# EAGLE design quadbase_ble113 (EAGLE 7.2.0)
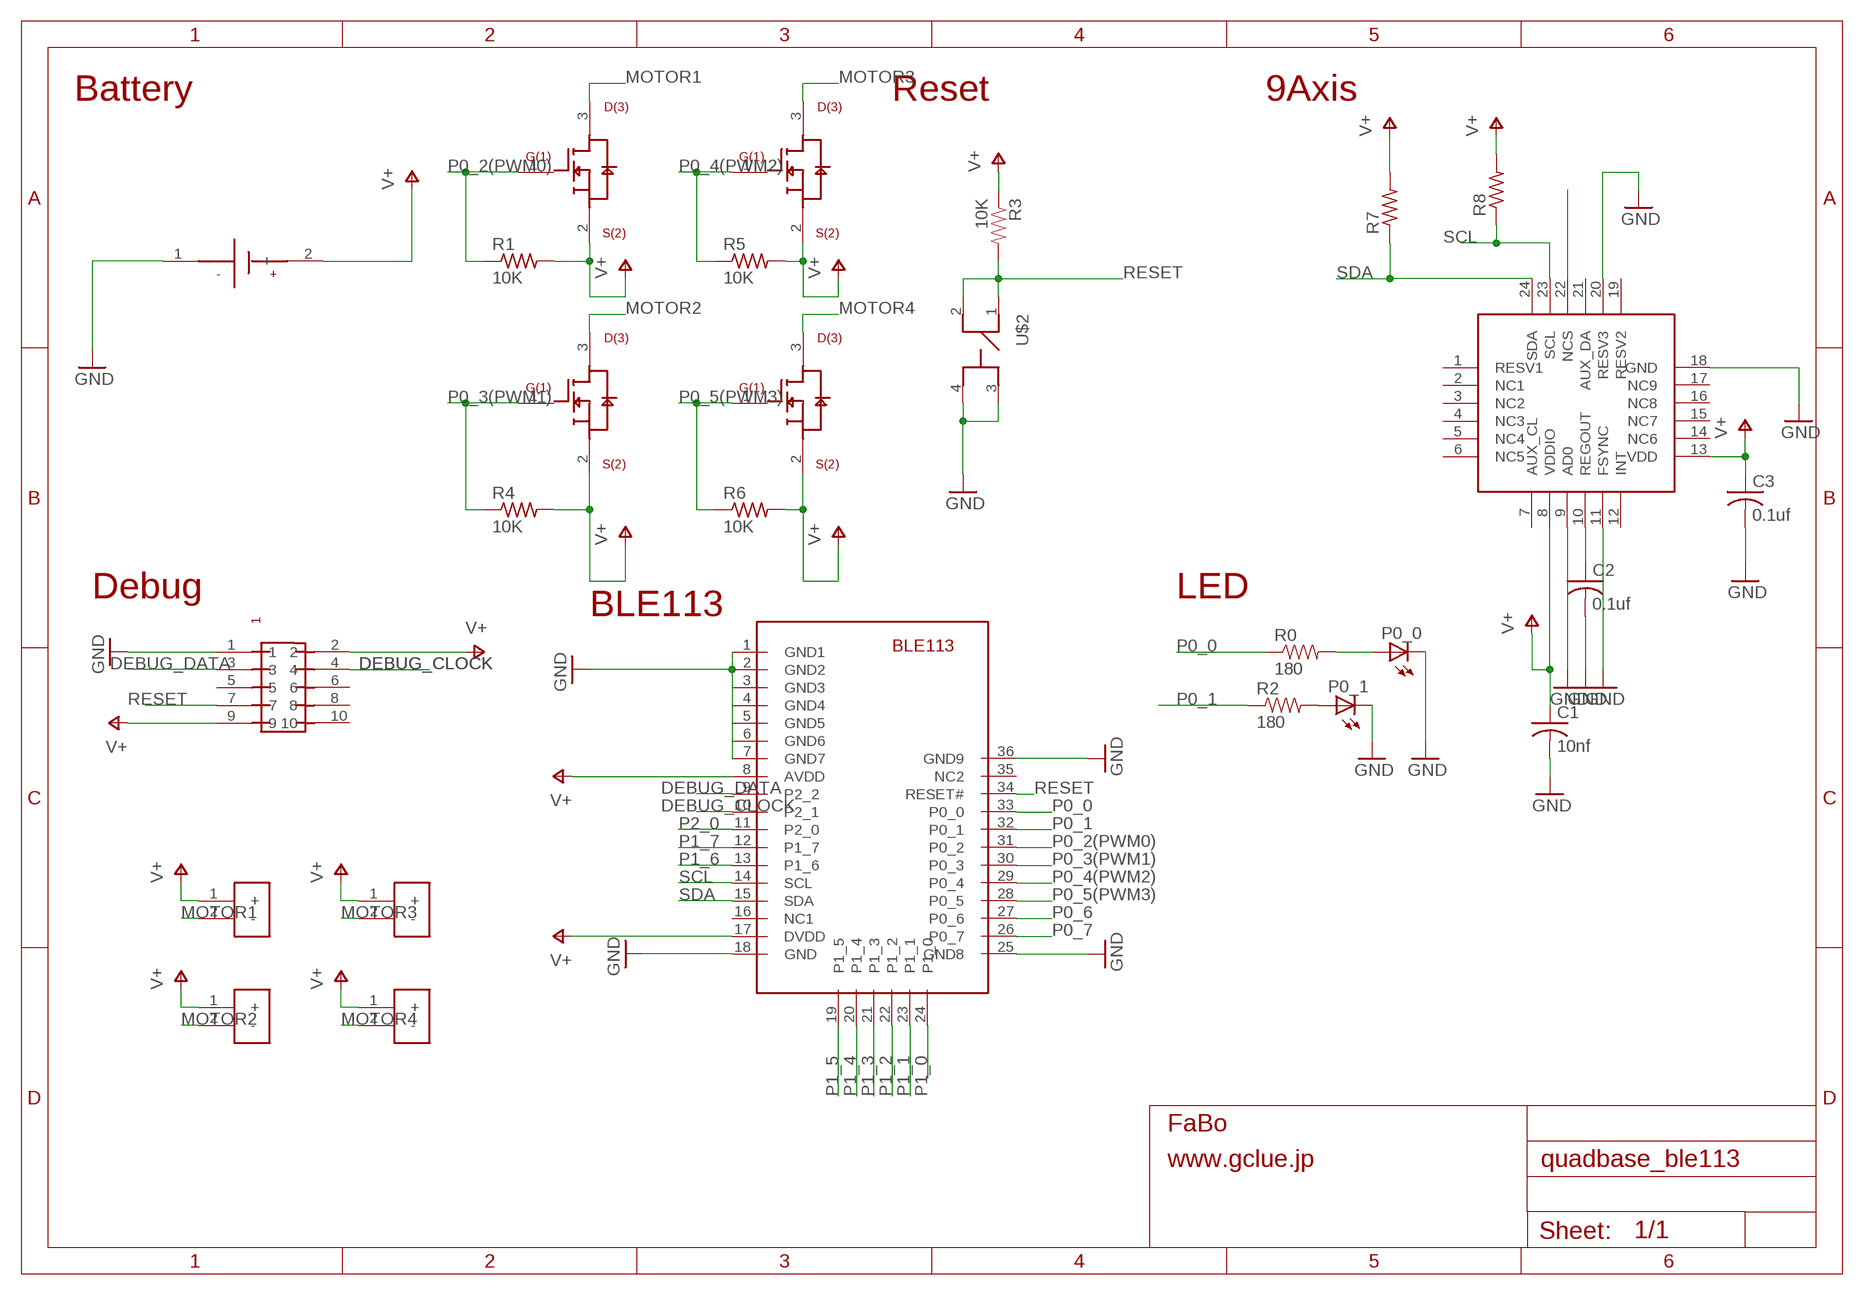
[diagram p0: schematic, sheet 1]

## Parts
C1  10nf  C-USC0603  [C0603]
C2  0.1uf  C-USC0603  [C0603]
C3  0.1uf  C-USC0603  [C0603]
MOTOR1  SMD-MOTOR  [SMD-MOTOR]
MOTOR2  SMD-MOTOR  [SMD-MOTOR]
MOTOR3  SMD-MOTOR  [SMD-MOTOR]
MOTOR4  SMD-MOTOR  [SMD-MOTOR]
P0_0  LEDCHIP-LED0603  [CHIP-LED0603]
P0_1  LEDCHIP-LED0603  [CHIP-LED0603]
R0  180  RESISTOR0603-RES  [0603-RES]
R1  10K  R-US_R0603  [R0603]
R2  180  RESISTOR0603-RES  [0603-RES]
R3  10K  RESISTOR0603-RES  [0603-RES]
R4  10K  R-US_R0603  [R0603]
R5  10K  R-US_R0603  [R0603]
R6  10K  R-US_R0603  [R0603]
R7  R-US_R0603  [R0603]
R8  R-US_R0603  [R0603]
U$1  SMD-SUPPLY  [SMD_SUPPLY]
U$2  SWITCH-LS6J2M-T  [SWITCH-LS6J2M-T]
U$3  PIN-HEADER-SMT(1.27MM)2X5  [PIN-HEADER-SMT(1.27MM)2X5]
U$4  BLE113  [BLE113]
U$5  VISHAY-SI2318CDS  [VISHAY-SI2318CDS]
U$7  VISHAY-SI2318CDS  [VISHAY-SI2318CDS]
U$8  VISHAY-SI2318CDS  [VISHAY-SI2318CDS]
U$9  VISHAY-SI2318CDS  [VISHAY-SI2318CDS]
U$10  INVENSENSE-MPU9250  [INVENSENSE-MPU9250]

## Nets
DEBUG_CLOCK: U$3.4 U$4.10(P2_1)
DEBUG_DATA: U$3.3 U$4.9(P2_2)
GND: C1.2 C2.2 C3.2 P0_0.C P0_1.C U$1.1(-) U$2.3 U$2.4 U$3.1 U$4.1(GND1) U$4.2(GND2) U$4.3(GND3) U$4.4(GND4) U$4.5(GND5) U$4.6(GND6) U$4.7(GND7) U$4.18(GND) U$4.25(GND8) U$4.36(GND9) U$10.9(AD0) U$10.11(FSYNC) U$10.18(GND) U$10.20(RESV3)
MOTOR1: MOTOR1.2(-) U$5.3
MOTOR2: MOTOR2.2(-) U$7.3
MOTOR3: MOTOR3.2(-) U$8.3
MOTOR4: MOTOR4.2(-) U$9.3
N$1: C2.1 U$10.10(REGOUT)
N$2: P0_0.A R0.2
N$3: P0_1.A R2.2
N$6: U$10.22(NCS)
P0_0: R0.1 U$4.33(P0_0)
P0_1: R2.1 U$4.32(P0_1)
P0_2(PWM0): R1.1 U$4.31(P0_2) U$5.1
P0_3(PWM1): R4.1 U$4.30(P0_3) U$7.1
P0_4(PWM2): R5.1 U$4.29(P0_4) U$8.1
P0_5(PWM3): R6.1 U$4.28(P0_5) U$9.1
P0_6: U$4.27(P0_6)
P0_7: U$4.26(P0_7)
P1_0: U$4.24(P1_0)
P1_1: U$4.23(P1_1)
P1_2: U$4.22(P1_2)
P1_3: U$4.21(P1_3)
P1_4: U$4.20(P1_4)
P1_5: U$4.19(P1_5)
P1_6: U$4.13(P1_6)
P1_7: U$4.12(P1_7)
P2_0: U$4.11(P2_0)
RESET: R3.2 U$2.1 U$2.2 U$3.7 U$4.34(RESET#)
SCL: R8.1 U$4.14(SCL) U$10.23(SCL)
SDA: R7.1 U$4.15(SDA) U$10.24(SDA)
V+: C1.1 C3.1 MOTOR1.1(+) MOTOR2.1(+) MOTOR3.1(+) MOTOR4.1(+) R1.2 R3.1 R4.2 R5.2 R6.2 R7.2 R8.2 U$1.2(+) U$3.2 U$3.9 U$4.8(AVDD) U$4.17(DVDD) U$5.2 U$7.2 U$8.2 U$9.2 U$10.8(VDDIO) U$10.13(VDD)
Unconnected: U$3.5 U$3.6 U$3.8 U$3.10 U$4.16(NC1) U$4.35(NC2) U$10.1(RESV1) U$10.2(NC1) U$10.3(NC2) U$10.4(NC3) U$10.5(NC4) U$10.6(NC5) U$10.7(AUX_CL) U$10.12(INT) U$10.14(NC6) U$10.15(NC7) U$10.16(NC8) U$10.17(NC9) U$10.19(RESV2) U$10.21(AUX_DA)

## Notes on the sheet
- Battery | Reset | 9Axis
- Debug | LED
- BLE113

## Library data of the parts
C1-C3 = adafruit:C-US: CAPACITOR, American symbol
MOTOR1-MOTOR4 = gclueParts:SMD-MOTOR
P0_0 P0_1 = led:LED: LED OSRAM: - CHIPLED LG R971, LG N971, LY N971, LG Q971, LY Q971, LO R971, LY R971 LH N974, LH R974 LS Q976, LO Q976, LY Q976 LO Q996 - Hyper CHIPLED LW Q18S LB Q993, LB Q99A, LB R99A - SideLED LS A670, LO A670, LY A670, LG A670, LP A670 LB A673, LV A673, LT A673, LW A673 LH A674 LY A675 LS A676, LA A676, LO A676, LY A676, LW A676 LS A679, LY A679, LG A679 - Hyper Micro SIDELED® LS Y876, LA Y876, LO Y876, LY Y876 LT Y87S - SmartLED LW L88C, LW L88S LB L89C, LB L89S, LG L890 LS L89K, LO L89K, LY L89K LS L896, LA L896, LO L896, LY L896 - TOPLED LS T670, LO T670, LY T670, LG T670, LP T670 LSG T670, LSP T670, LSY T670, LOP T670, LYG T670 LG T671, LOG T671, LSG T671 LB T673, LV T673, LT T673, LW T673 LH T674 LS T676, LA T676, LO T676, LY T676, LB T676, LH T676, LSB T676, LW T676 LB T67C, LV T67C, LT T67C, LS T67K, LO T67K, LY T67K, LW E67C LS E67B, LA E67B, LO E67B, LY E67B, LB E67C, LV E67C, LT E67C LW T67C LS T679, LY T679, LG T679 LS T770, LO T770, LY T770, LG T770, LP T770 LB T773, LV T773, LT T773, LW T773 LH T774 LS E675, LA E675, LY E675, LS T675 LS T776, LA T776, LO T776, LY T776, LB T776 LHGB T686 LT T68C, LB T68C - Hyper Mini TOPLED® LB M676 - Mini TOPLED Santana® LG M470 LS M47K, LO M47K, LY M47K Source: http://www.osram.convergy.de LUXEON: - LUMILED® LXK2-PW12-R00, LXK2-PW12-S00, LXK2-PW14-U00, LXK2-PW14-V00 LXK2-PM12-R00, LXK2-PM12-S00, LXK2-PM14-U00 LXK2-PE12-Q00, LXK2-PE12-R00, LXK2-PE12-S00, LXK2-PE14-T00, LXK2-PE14-U00 LXK2-PB12-K00, LXK2-PB12-L00, LXK2-PB12-M00, LXK2-PB14-N00, LXK2-PB14-P00, LXK2-PB14-Q00 LXK2-PR12-L00, LXK2-PR12-M00, LXK2-PR14-Q00, LXK2-PR14-R00 LXK2-PD12-Q00, LXK2-PD12-R00, LXK2-PD12-S00 LXK2-PH12-R00, LXK2-PH12-S00 LXK2-PL12-P00, LXK2-PL12-Q00, LXK2-PL12-R00 Source: www.luxeon.com KINGBRIGHT: KA-3528ASYC Source: www.kingbright.com
R0 R2 R3 = SparkFun:RESISTOR: Resistor Basic schematic elements and footprints for 0603, 1206, and PTH resistors.
R1 R4-R8 = adafruit:R-US_: RESISTOR, American symbol
U$1 = gclueParts:SMD-SUPPLY
U$2 = gclue:SWITCH-LS6J2M-T: Switch Tact SMD(LS6J2M-T)
U$3 = gclue-test:PIN-HEADER-SMT(1.27MM)2X5: PIN-HEADER-SMT (1.27MM) 2x5
U$4 = gclue:BLE113
U$5 U$7-U$9 = gclueParts:VISHAY-SI2318CDS
U$10 = gclueSensor:INVENSENSE-MPU9250

## Board
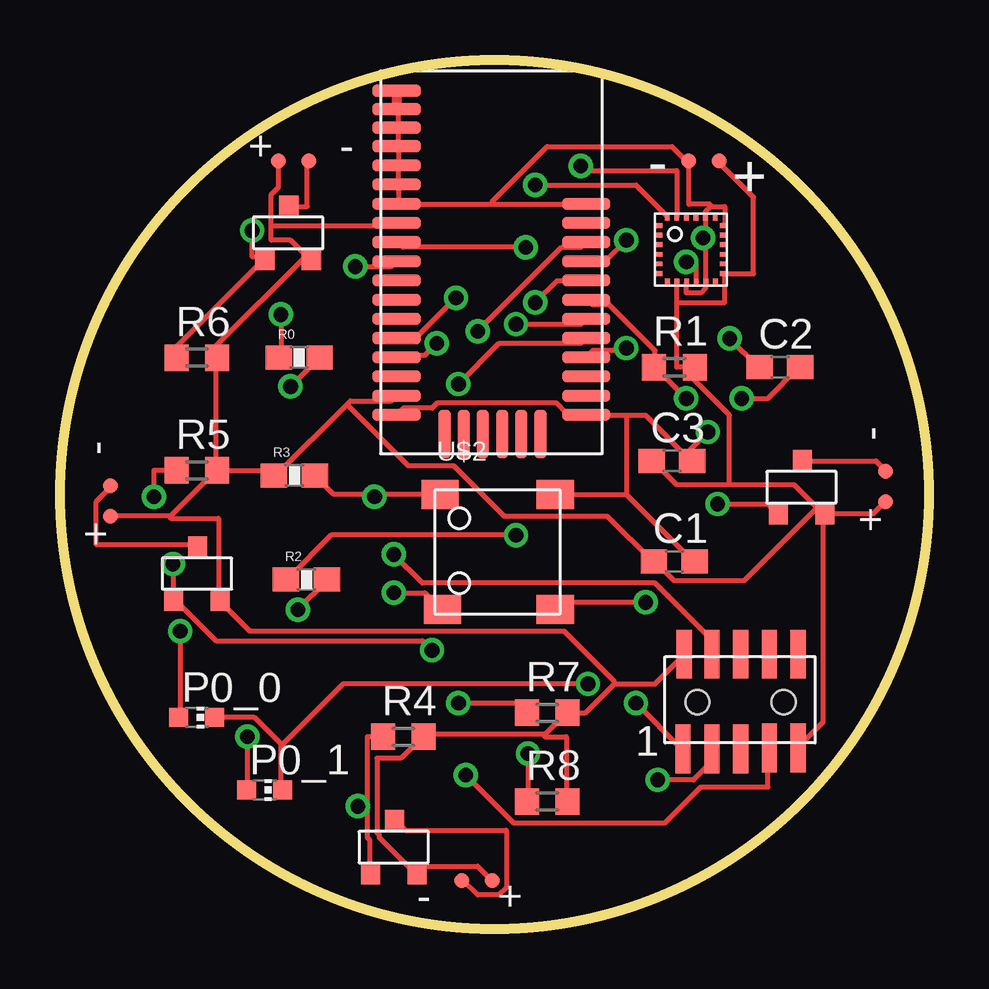
[diagram p1: board, top side]
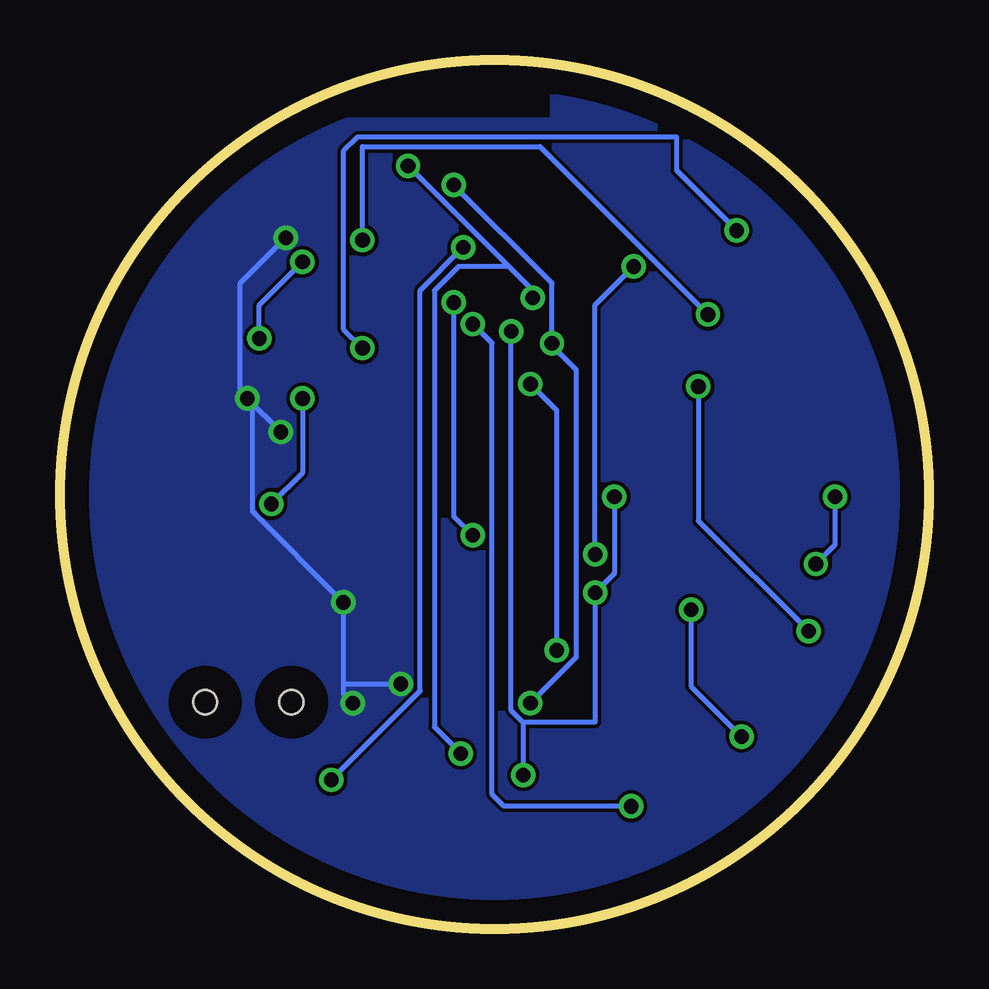
[diagram p2: board, bottom side, seen from below]

Size 36.22 x 36.22 mm. Coordinates in mm from the lower left corner, seen from the top.
Outline: circle at 18.11,18.11 radius 18.11
Copper layers (1*16): Top 0.035mm / dielectric 1.5mm / Bottom 0.035mm
Design rules "default *": minimum track width 8mil, minimum drill 24mil, track to track 6mil, track to pad 6mil, pad to pad 6mil, via to via 6mil, smd to smd 6mil, copper to edge 40mil, drill to drill 6mil, minimum pad ring 10mil, minimum via ring 8mil, stop-mask expansion 4mil, vias tented up to drill 0mil, thermal gap 10mil

### Footprints (pad centres in the part's own frame; a part is rotated, then mirrored left to right if it is on the bottom)
C0603 = smd 1.1 x 1: 1 -0.85,0; 2 0.85,0
SMD-MOTOR = smd 0.635 x 0.635: 1 0,0; 2 1.27,0
CHIP-LED0603 = smd 0.8 x 0.8: A 0,-0.75; C 0,0.75
0603-RES = smd 1.1 x 1: 1 -0.85,0; 2 0.85,0
R0603 = smd 1 x 1.1: 1 -0.85,0; 2 0.85,0
SMD_SUPPLY = smd 0.635 x 0.635: 1 0,0; 2 1.27,0
SWITCH-LS6J2M-T = smd 1.55 x 1.2: 1 -2.4,2.4; 2 -2.3,-2.4; 3 2.4,2.4; 4 2.4,-2.4
PIN-HEADER-SMT(1.27MM)2X5 = smd 0.635 x 2.032: 1 -2.8,-1.65; 2 -2.75,2.3; 3 -1.6,-1.65; 4 -1.6,2.3; 5 -0.4,-1.65; 6 -0.4,2.3; 7 0.8,-1.6; 8 0.8,2.3; 9 2,-1.6; 10 2,2.3 | hole 1: 1.4,0.3; -2.2,0.3
BLE113 = smd 2 x 0.5: 1 -5.08,5.08; 2 -5.08,4.31; 3 -5.08,3.54; 4 -5.08,2.77; 5 -5.08,1.97; 6 -5.08,1.17; 7 -5.08,0.37; 8 -5.08,-0.43; 9 -5.08,-1.23; 10 -5.08,-2.03; 11 -5.08,-2.83; 12 -5.08,-3.63; 13 -5.08,-4.43; 14 -5.08,-5.23; 15 -5.08,-6.03; 16 -5.08,-6.83; 17 -5.08,-7.63; 18 -5.08,-8.43; 25 2.82,-8.43; 26 2.82,-7.63; 27 2.82,-6.83; 28 2.82,-6.03; 29 2.82,-5.23; 30 2.82,-4.43; 31 2.82,-3.63; 32 2.82,-2.83; 33 2.82,-2.03; 34 2.82,-1.23; 35 2.82,-0.43; 36 2.82,0.37 | smd 0.5 x 2: 19 -3.08,-9.23; 20 -2.28,-9.23; 21 -1.48,-9.23; 22 -0.68,-9.23; 23 0.12,-9.23; 24 0.92,-9.23
VISHAY-SI2318CDS = smd 0.8 x 0.9: 1 -0.97,-1.1; 2 0.97,-1.1; 3 0.03,1.1
INVENSENSE-MPU9250 = smd 0.3 x 0.2: 1 -1.35,1.01; 2 -1.35,0.61; 3 -1.35,0.21; 4 -1.35,-0.19; 5 -1.35,-0.59; 6 -1.35,-0.99; 13 1.34,-0.99; 14 1.34,-0.59; 15 1.34,-0.19; 16 1.34,0.21; 17 1.34,0.61; 18 1.34,1.01 | smd 0.2 x 0.3: 7 -0.99,-1.36; 8 -0.59,-1.36; 9 -0.19,-1.36; 10 0.21,-1.36; 11 0.61,-1.36; 12 1.01,-1.36; 19 1,1.36; 20 0.6,1.36; 21 0.2,1.36; 22 -0.2,1.36; 23 -0.6,1.36; 24 -1,1.36

### Placement (x,y rotation side)
C1  25.61,15.31 0 top
C2  30.01,23.41 0 top
C3  25.51,19.51 0 top
MOTOR1  34.41,17.81 90 top
MOTOR2  18.01,2.01 180 top
MOTOR3  2.11,17.21 90 top
MOTOR4  9.11,32.01 0 top
P0_0  5.7,8.81 270 top
P0_1  8.53,5.79 270 top
R0  9.97,23.82 0 top
R1  25.61,23.41 0 top
R2  10.27,14.56 0 top
R3  9.77,18.9 0 top
R4  14.31,8.01 0 top
R5  5.71,19.11 0 top
R6  5.71,23.81 0 top
R7  20.31,9.01 0 top
R8  20.31,5.31 0 top
U$1  26.21,32.01 0 top
U$2  18.24,15.71 0 top
U$3  28.77,9.15 0 top
U$4  19.11,29.86 0 top
U$5  30.91,18.41 0 top
U$7  13.91,3.41 0 top
U$8  5.71,14.81 0 top
U$9  9.51,29.01 0 top
U$10  26.31,28.31 0 top

### Tracks (layer width: path | path; a pad name or v marks a point on that pad's centre or on a via)
DEBUG_CLOCK  (via drill 0.61)
  Top 0.203: U$4.10 13.81,27.61 v12.31,27.61 | v13.91,15.61 15.11,14.41 24.81,14.41 27.11,12.11 27.11,11.51 U$3.4
  Bottom 0.203: v12.31,27.61 13.91,26.01 v13.91,15.61
DEBUG_DATA  (via drill 0.61)
  Top 0.203: v19.41,28.41 14.31,28.41 14.11,28.61 U$4.9 | v24.91,6.21 26.41,6.21 27.11,6.91 27.11,7.41 U$3.3
  Bottom 0.203: v19.41,28.41 21.21,26.61 21.21,9.91 v24.91,6.21
GND  (via drill 0.61)
  Top 0.203: U$4.2 14.11,34.11 14.11,33.41 U$4.3 14.11,33.31 14.11,32.71 U$4.4 14.11,32.61 14.11,31.91 U$4.5 14.11,31.81 14.11,31.11 U$4.6 14.11,31.01 14.11,30.31 U$4.7 14.11,30.21 18.01,30.21 | U$10.9 26.11,26.91 26.11,26.51 26.71,26.51 26.91,26.71 26.91,26.91 U$10.11 26.91,27.01 26.91,28.81 | 27.11,30.11 27.71,30.11 27.71,29.41 U$10.18 | 27.11,30.11 26.91,29.91 U$10.20 26.91,28.81 | 27.11,30.11 27.11,30.21 26.21,30.21 U$1.1 26.11,32.01 25.51,32.61 20.31,32.61 18.01,30.31 18.01,30.21 | 18.01,30.21 21.91,30.21 U$4.36 | 23.61,18.11 26.41,15.31 C1.2 | U$2.3 23.61,18.11 | P0_0.C 8.11,8.81 9.21,7.71 | 9.21,7.71 9.21,5.81 P0_1.C | 23.61,21.41 22.01,21.41 U$4.25 21.91,21.51 21.11,21.51 20.71,21.91 15.71,21.91 15.51,21.71 14.31,21.71 U$4.18 | 23.61,21.41 24.41,21.41 26.31,19.51 C3.2 26.11,19.81 v27.01,20.71 | v28.41,22.11 29.51,22.11 30.81,23.41 C2.2 | v24.41,13.61 21.01,13.61 20.71,13.31 U$2.4 | v24.01,9.41 25.91,7.51 U$3.1 | v22.01,10.21 11.81,10.21 9.31,7.71 9.21,7.71 | 23.61,21.41 23.61,18.11 | v26.81,28.81 26.91,28.81
  Top 0.406: U$4.1 U$4.2
  Bottom 0.203: v27.01,20.71 v28.41,22.11 | v28.41,22.11 28.21,21.81 28.21,17.41 v24.41,13.61 24.41,10.21 | v24.01,9.41 24.41,9.81 24.41,10.21 | 24.41,10.21 v22.01,10.21 | v26.81,28.81 28.71,26.91 28.71,22.51 28.41,22.21 v28.41,22.11
  pour Bottom: 0.01,0.11 -0.19,0.11 -0.19,35.31 15.61,35.31 15.61,33.61 37.21,33.61 37.21,-0.19 0.41,-0.19 0.41,0.11
MOTOR1
  Top 0.203: U$5.3 34.01,19.51 34.41,19.11 MOTOR1.2
MOTOR2
  Top 0.203: MOTOR2.2 16.81,2.01 17.41,1.41 18.31,1.41 18.61,1.71 18.61,4.11 14.41,4.11 14.01,4.51 U$7.3
MOTOR3
  Top 0.203: MOTOR3.2 2.11,18.41 1.51,17.81 1.51,16.01 5.61,16.01 5.71,15.91 U$8.3
MOTOR4
  Top 0.203: U$9.3 10.31,30.11 10.31,32.01 MOTOR4.2
N$1  (via drill 0.61)
  Top 0.203: v26.11,27.81 26.51,27.81 26.51,27.01 U$10.10 | v27.91,24.61 29.11,23.41 C2.1
  Bottom 0.203: v26.11,27.81 27.91,26.01 v27.91,24.61
N$2  (via drill 0.61)
  Top 0.203: v5.01,12.41 5.01,8.81 P0_0.A | R0.2 v9.61,22.61
  Bottom 0.203: v5.01,12.41 9.61,17.01 v9.61,22.61
N$3  (via drill 0.61)
  Top 0.203: v7.81,8.01 7.81,5.81 P0_1.A | v9.91,13.31 11.11,14.51 R2.2
  Bottom 0.203: v7.81,8.01 9.91,10.11 v9.91,13.31
P0_0  (via drill 0.61)
  Top 0.203: v9.21,25.61 9.21,23.91 R0.1 | v23.61,28.71 22.81,27.91 22.01,27.91 U$4.33
  Bottom 0.203: v9.21,25.61 16.21,32.61 23.61,32.61 v23.61,28.71
P0_1  (via drill 0.61)
  Top 0.203: v19.01,16.41 11.31,16.41 9.51,14.61 R2.1 | v19.81,26.11 20.71,27.01 21.91,27.01 U$4.32
  Bottom 0.203: v19.01,16.41 19.81,17.21 v19.81,26.11
P0_2(PWM0)  (via drill 0.61)
  Top 0.203: v27.41,17.71 29.51,17.71 29.91,17.31 U$5.1 | v26.11,22.11 24.81,23.41 R1.1 24.81,23.51 24.81,24.11 22.91,26.01 22.21,26.01 22.01,26.21 U$4.31
  Bottom 0.203: v27.41,17.71 26.11,19.01 v26.11,22.11
P0_3(PWM1)  (via drill 0.61)
  Top 0.203: 12.81,5.11 12.81,8.01 R4.1 | 12.81,5.11 12.81,3.81 12.91,3.71 12.91,2.31 U$7.1 | U$4.30 21.71,25.21 v19.01,25.21 | 12.81,5.11 v12.41,5.11
  Bottom 0.203: v19.01,25.21 18.21,24.41 18.21,5.61 17.71,5.11 v12.41,5.11
P0_4(PWM2)  (via drill 0.61)
  Top 0.203: v4.71,15.21 4.71,13.71 U$8.1 4.81,13.71 6.51,12.01 15.11,12.01 v15.51,11.61 | v3.91,18.01 3.91,19.11 R5.1 | U$4.29 21.71,24.41 18.31,24.41 v16.61,22.71
  Bottom 0.203: v4.71,15.21 3.91,16.01 v3.91,18.01 | v16.61,22.71 15.51,21.61 v15.51,11.61
P0_5(PWM3)  (via drill 0.61)
  Top 0.203: R6.1 4.91,23.81 4.91,24.31 8.51,27.91 U$9.1 8.51,28.01 8.01,28.01 v8.01,29.11 | U$4.28 22.21,24.11 23.51,24.11 v23.61,24.21
  Bottom 0.203: v23.61,24.21 24.41,25.01 24.41,32.41 23.81,33.01 10.51,33.01 10.51,31.61 v8.01,29.11
RESET  (via drill 0.61)
  Top 0.203: R3.2 11.41,18.11 13.11,18.11 | U$2.1 13.11,18.11 | v13.91,14.01 15.21,14.01 15.91,13.31 U$2.2 | v13.11,18.01 13.11,18.11 | U$4.34 21.71,28.41 20.91,28.41 v17.41,24.91 | v16.91,6.41 18.91,4.41 25.21,4.41 26.71,5.91 29.51,5.91 29.51,7.51 U$3.7
  Bottom 0.203: v13.11,18.01 13.11,14.81 v13.91,14.01 13.91,8.61 16.91,8.61 | v17.41,24.91 17.41,9.11 16.91,8.61 | 16.91,8.61 v16.91,6.41
SCL  (via drill 0.61)
  Top 0.203: U$10.23 25.71,31.61 21.91,31.61 v21.71,31.81 | v16.51,26.31 14.91,24.71 14.11,24.71 U$4.14 | v19.51,7.31 19.51,5.31 R8.1
  Bottom 0.203: 17.56,27.66 16.51,26.61 v16.51,26.31 | 17.56,27.66 v21.71,31.81 | v19.51,7.31 20.61,8.41 20.61,26.61 19.61,27.61 17.61,27.61 17.56,27.66
SDA  (via drill 0.61)
  Top 0.203: v19.81,31.01 24.01,31.01 25.31,29.71 U$10.24 | v15.71,24.41 15.21,23.91 14.11,23.91 U$4.15 | v16.61,9.41 19.01,9.41 19.41,9.01 R7.1
  Bottom 0.203: v19.81,31.01 15.71,26.91 v15.71,24.41 15.71,24.31 14.71,23.31 14.71,11.31 v16.61,9.41
V+
  Top 0.203: 25.71,26.11 25.71,23.41 R1.2 26.41,23.31 26.41,22.91 27.91,21.41 27.91,18.51 | 25.71,26.11 25.71,26.91 U$10.8 | 27.71,27.31 27.71,26.11 25.71,26.11 | 27.71,27.31 U$10.13 | 27.71,27.31 28.91,27.31 28.91,30.51 27.41,32.01 U$1.2 | MOTOR1.1 33.91,17.31 U$5.2 | 27.91,18.51 30.61,18.51 31.81,17.31 U$5.2 | 27.91,18.51 25.71,18.51 24.71,19.51 C3.1 | U$5.2 31.51,17.51 28.51,14.51 25.61,14.51 24.81,15.31 C1.1 24.71,15.31 22.81,17.21 18.51,17.21 16.41,19.31 14.51,19.31 11.96,21.86 | U$3.9 30.81,7.61 31.81,8.61 31.81,17.21 U$5.2 | MOTOR2.1 17.41,2.61 15.21,2.61 14.91,2.31 U$7.2 14.81,2.31 13.31,3.81 13.31,3.91 13.21,4.01 13.21,7.11 14.21,7.11 15.11,8.01 R4.2 15.21,8.01 15.31,8.11 20.21,8.11 | 20.21,8.11 21.11,9.01 R7.2 21.91,9.01 23.11,10.21 | R8.2 21.11,5.31 21.11,8.01 20.21,8.01 20.21,8.11 | 23.11,10.21 24.81,10.21 26.01,11.41 U$3.2 | MOTOR4.1 9.11,30.91 8.81,30.61 8.81,29.31 | 8.81,29.31 8.81,28.71 9.61,28.71 10.41,27.91 U$9.2 10.21,28.01 6.51,24.31 6.51,23.91 R6.2 6.51,23.81 6.51,19.21 R5.2 | U$4.8 13.91,29.31 8.81,29.31 | 4.61,17.21 MOTOR3.1 | 4.61,17.21 6.51,19.11 R5.2 | 4.61,17.21 4.61,17.11 6.61,17.11 6.61,13.71 U$8.2 6.71,13.61 7.91,12.41 21.01,12.41 23.11,10.31 23.11,10.21 | R5.2 8.71,19.11 R3.1 9.01,18.91 11.96,21.86 | U$4.17 13.81,22.01 12.11,22.01 11.96,21.86

### Text on the board
tPlace: - | +